# EAGLE design Weihnachtsstern (EAGLE 9.5.1)
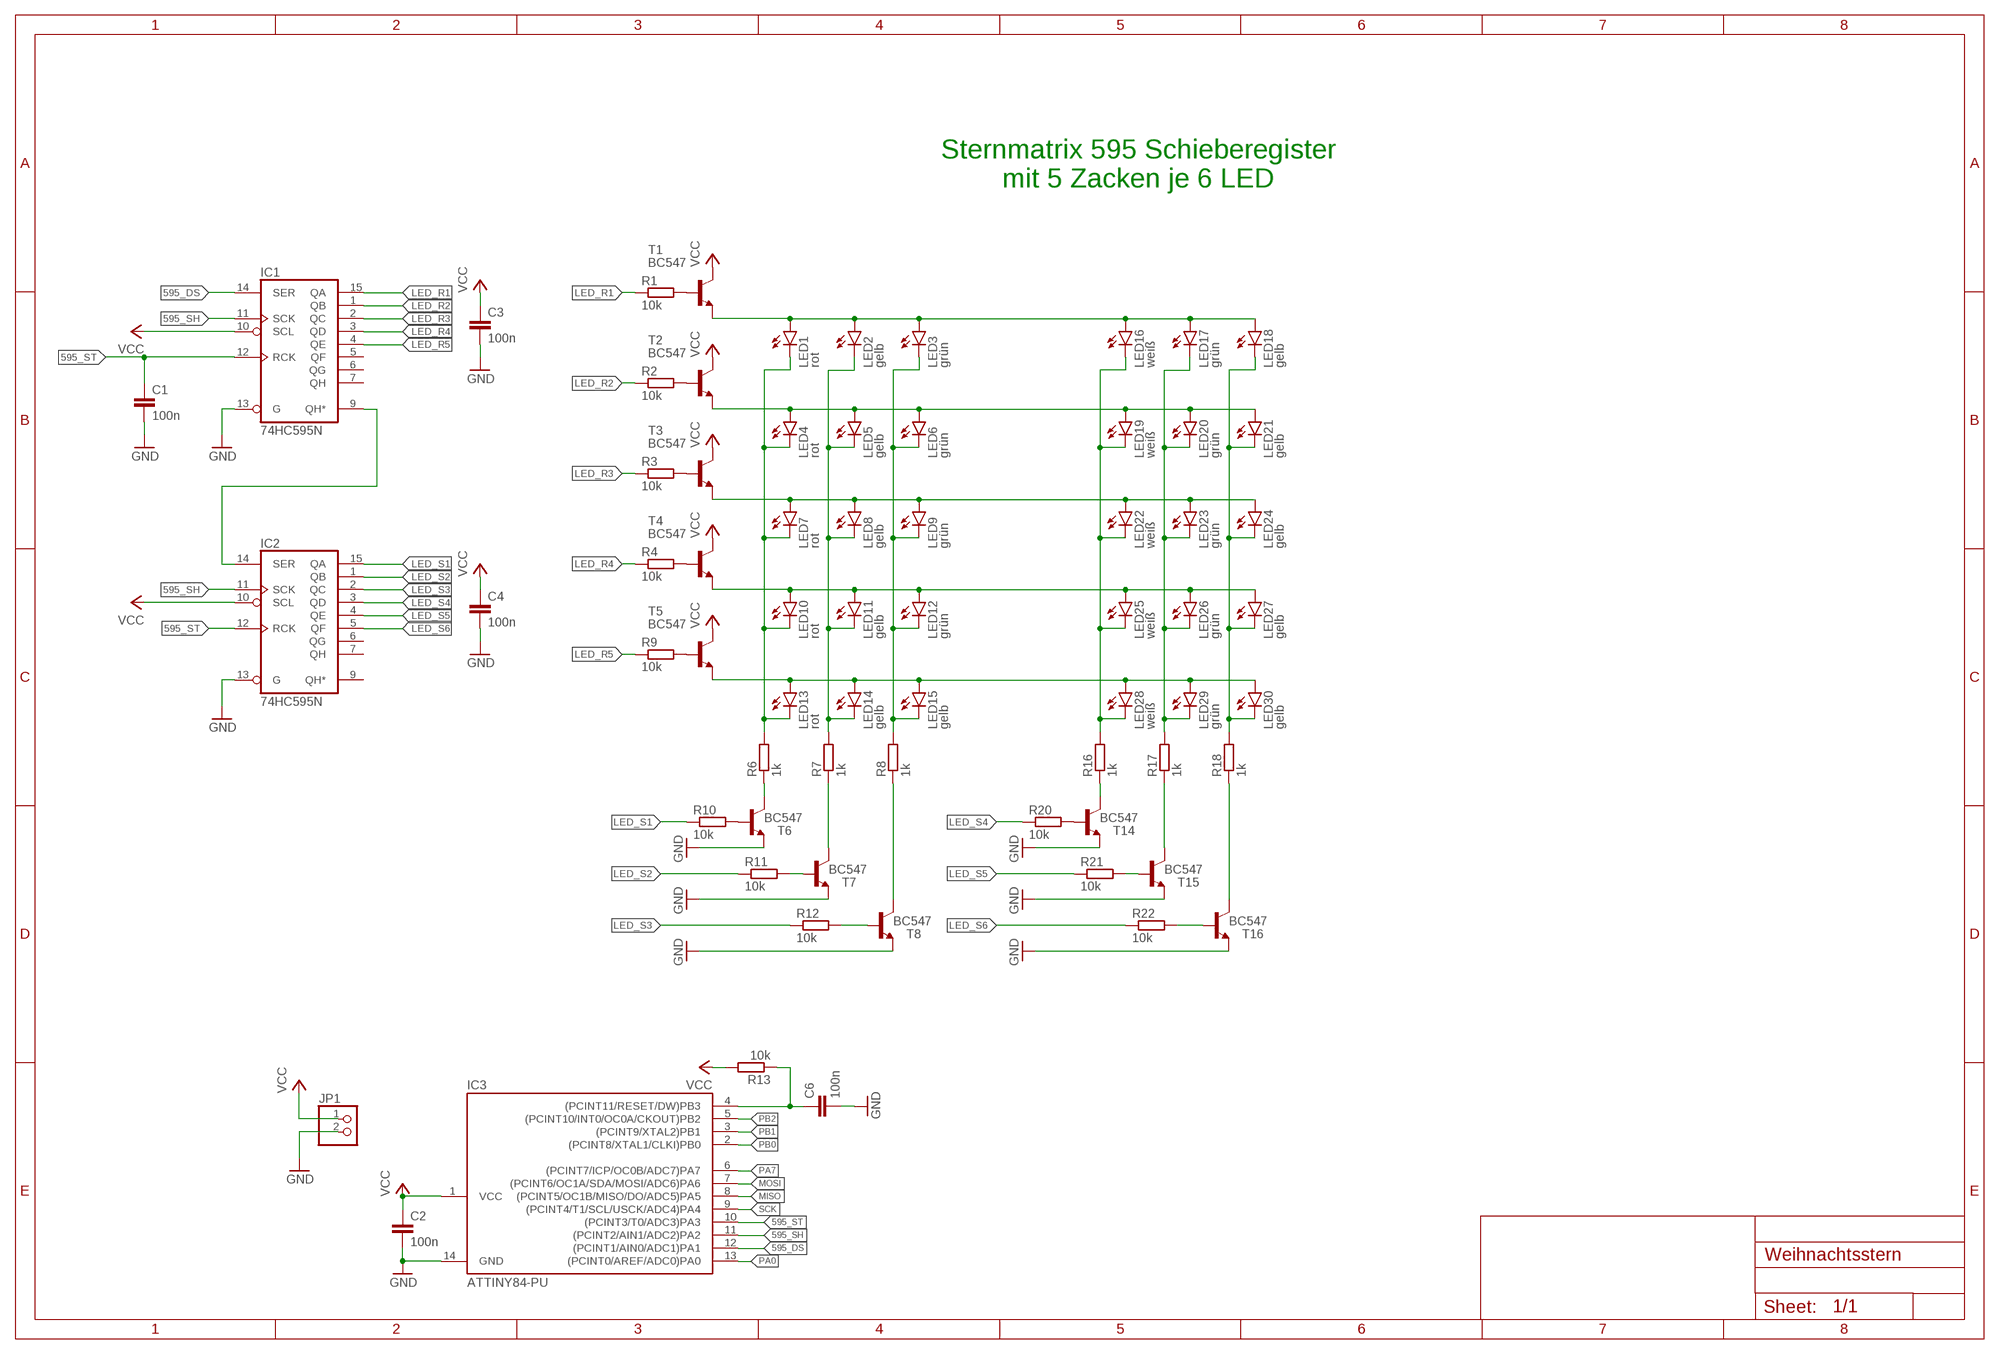
[diagram p0: schematic, sheet 1]

## Parts
C1  100n  C-EU025-024X044  [C025-024X044]
C2  100n  C-EU025-024X044  [C025-024X044]
C3  100n  C-EU025-024X044  [C025-024X044]
C4  100n  C-EU025-024X044  [C025-024X044]
C6  100n  C-EU025-024X044  [C025-024X044]
IC1  74HC595N  [DIL16]
IC2  74HC595N  [DIL16]
IC3  ATTINY84-PU  ATTINY24/44/84-PU  [DIL14]
JP1  PINHD-1X2  [1X02]
LED1  rot  LED3MM  [LED3MM]
LED2  gelb  LED3MM  [LED3MM]
LED3  grün  LED3MM  [LED3MM]
LED4  rot  LED3MM  [LED3MM]
LED5  gelb  LED3MM  [LED3MM]
LED6  grün  LED3MM  [LED3MM]
LED7  rot  LED3MM  [LED3MM]
LED8  gelb  LED3MM  [LED3MM]
LED9  grün  LED3MM  [LED3MM]
LED10  rot  LED3MM  [LED3MM]
LED11  gelb  LED3MM  [LED3MM]
LED12  grün  LED3MM  [LED3MM]
LED13  rot  LED3MM  [LED3MM]
LED14  gelb  LED3MM  [LED3MM]
LED15  gelb  LED3MM  [LED3MM]
LED16  weiß  LED3MM  [LED3MM]
LED17  grün  LED3MM  [LED3MM]
LED18  gelb  LED3MM  [LED3MM]
LED19  weiß  LED3MM  [LED3MM]
LED20  grün  LED3MM  [LED3MM]
LED21  gelb  LED3MM  [LED3MM]
LED22  weiß  LED3MM  [LED3MM]
LED23  grün  LED3MM  [LED3MM]
LED24  gelb  LED3MM  [LED3MM]
LED25  weiß  LED3MM  [LED3MM]
LED26  grün  LED3MM  [LED3MM]
LED27  gelb  LED3MM  [LED3MM]
LED28  weiß  LED3MM  [LED3MM]
LED29  grün  LED3MM  [LED3MM]
LED30  gelb  LED3MM  [LED3MM]
R1  10k  R-EU_0204/5  [0204/5]
R2  10k  R-EU_0204/5  [0204/5]
R3  10k  R-EU_0204/5  [0204/5]
R4  10k  R-EU_0204/5  [0204/5]
R6  1k  R-EU_0204/5  [0204/5]
R7  1k  R-EU_0204/5  [0204/5]
R8  1k  R-EU_0204/5  [0204/5]
R9  10k  R-EU_0204/5  [0204/5]
R10  10k  R-EU_0204/5  [0204/5]
R11  10k  R-EU_0204/5  [0204/5]
R12  10k  R-EU_0204/5  [0204/5]
R13  10k  R-EU_0204/5  [0204/5]
R16  1k  R-EU_0204/5  [0204/5]
R17  1k  R-EU_0204/5  [0204/5]
R18  1k  R-EU_0204/5  [0204/5]
R20  10k  R-EU_0204/5  [0204/5]
R21  10k  R-EU_0204/5  [0204/5]
R22  10k  R-EU_0204/5  [0204/5]
T1  BC547  [TO92]
T2  BC547  [TO92]
T3  BC547  [TO92]
T4  BC547  [TO92]
T5  BC547  -NPN-TO92  [TO92]
T6  BC547  [TO92]
T7  BC547  [TO92]
T8  BC547  [TO92]
T14  BC547  [TO92]
T15  BC547  [TO92]
T16  BC547  [TO92]

## Nets
595_DS: IC1.14(SER) IC3.12((PCINT1/AIN0/ADC1)PA1)
595_SH: IC1.11(SCK) IC2.11(SCK) IC3.11((PCINT2/AIN1/ADC2)PA2)
595_ST: C1.1 IC1.12(RCK) IC2.12(RCK) IC3.10((PCINT3/T0/ADC3)PA3)
GND: C1.2 C2.2 C3.2 C4.2 C6.2 IC1.13(G) IC2.13(G) IC3.14(GND) JP1.2 T6.1(E) T7.1(E) T8.1(E) T14.1(E) T15.1(E) T16.1(E)
LED_R1: IC1.15(QA) R1.1
LED_R2: IC1.1(QB) R2.1
LED_R3: IC1.2(QC) R3.1
LED_R4: IC1.3(QD) R4.1
LED_R5: IC1.4(QE) R9.1
LED_S1: IC2.15(QA) R10.1
LED_S2: IC2.1(QB) R11.1
LED_S3: IC2.2(QC) R12.1
LED_S4: IC2.3(QD) R20.1
LED_S5: IC2.4(QE) R21.1
LED_S6: IC2.5(QF) R22.1
MISO: IC3.8((PCINT5/OC1B/MISO/DO/ADC5)PA5)
MOSI: IC3.7((PCINT6/OC1A/SDA/MOSI/ADC6)PA6)
N$7: R7.1 T7.3(C)
N$9: R1.2 T1.2(B)
N$10: R2.2 T2.2(B)
N$11: R3.2 T3.2(B)
N$12: R4.2 T4.2(B)
N$14: R6.1 T6.3(C)
N$16: R8.1 T8.3(C)
N$17: R9.2 T5.2(B)
N$18: R10.2 T6.2(B)
N$19: R11.2 T7.2(B)
N$20: R12.2 T8.2(B)
N$24: R16.1 T14.3(C)
N$25: R18.1 T16.3(C)
N$27: R20.2 T14.2(B)
N$28: R21.2 T15.2(B)
N$29: R22.2 T16.2(B)
N$36: R17.1 T15.3(C)
PA0: IC3.13((PCINT0/AREF/ADC0)PA0)
PA7: IC3.6((PCINT7/ICP/OC0B/ADC7)PA7)
PB0: IC3.2((PCINT8/XTAL1/CLKI)PB0)
PB1: IC3.3((PCINT9/XTAL2)PB1)
PB2: IC3.5((PCINT10/INT0/OC0A/CKOUT)PB2)
R1: LED1.A LED2.A LED3.A LED16.A LED17.A LED18.A T1.1(E)
R2: LED4.A LED5.A LED6.A LED19.A LED20.A LED21.A T2.1(E)
R3: LED7.A LED8.A LED9.A LED22.A LED23.A LED24.A T3.1(E)
R4: LED10.A LED11.A LED12.A LED25.A LED26.A LED27.A T4.1(E)
R5: LED13.A LED14.A LED15.A LED28.A LED29.A LED30.A T5.1(E)
RESET: C6.1 IC3.4((PCINT11/RESET/DW)PB3) R13.1
S1: LED1.K(C) LED4.K(C) LED7.K(C) LED10.K(C) LED13.K(C) R6.2
S2: LED2.K(C) LED5.K(C) LED8.K(C) LED11.K(C) LED14.K(C) R7.2
S3: LED3.K(C) LED6.K(C) LED9.K(C) LED12.K(C) LED15.K(C) R8.2
S4: LED16.K(C) LED19.K(C) LED22.K(C) LED25.K(C) LED28.K(C) R16.2
S5: LED17.K(C) LED20.K(C) LED23.K(C) LED26.K(C) LED29.K(C) R17.2
S6: LED18.K(C) LED21.K(C) LED24.K(C) LED27.K(C) LED30.K(C) R18.2
SCK: IC3.9((PCINT4/T1/SCL/USCK/ADC4)PA4)
UELAUF: IC1.9(QH*) IC2.14(SER)
VCC: C2.1 C3.1 C4.1 IC1.10(SCL) IC2.10(SCL) IC3.1(VCC) JP1.1 R13.2 T1.3(C) T2.3(C) T3.3(C) T4.3(C) T5.3(C)
Unconnected: IC1.5(QF) IC1.6(QG) IC1.7(QH) IC2.6(QG) IC2.7(QH) IC2.9(QH*)

## Notes on the sheet
- Sternmatrix 595 Schieberegister
  mit 5 Zacken je 6 LED

## Power pins joined to a net without a drawn wire
GND: IC1.8(GND) IC2.8(GND)
VCC: IC1.16(VCC) IC2.16(VCC)

## Library data of the parts
C1-C4 C6 = rcl:C-EU: CAPACITOR, European symbol
IC1 IC2 = 74xx-eu:74*595: 8-bit SHIFT REGISTER, output latch
IC3 = attiny24_44_84:ATTINY24/44/84
JP1 = pinhead:PINHD-1X2: PIN HEADER
LED1-LED30 = MeineBibliothek:LED3MM: Kleine LED
R1-R4 R6-R13 R16-R18 R20-R22 = rcl:R-EU_: RESISTOR, European symbol
T1-T4 T6-T8 T14-T16 = transistor-neu-to92:BC547: NPN TRANSISTOR
T5 = transistor-neu-to92:*-NPN-: NPN Transistror

## Net classes
0 default: width 0.152 mm, drill 0.305 mm, clearance 0.254 mm

## Board
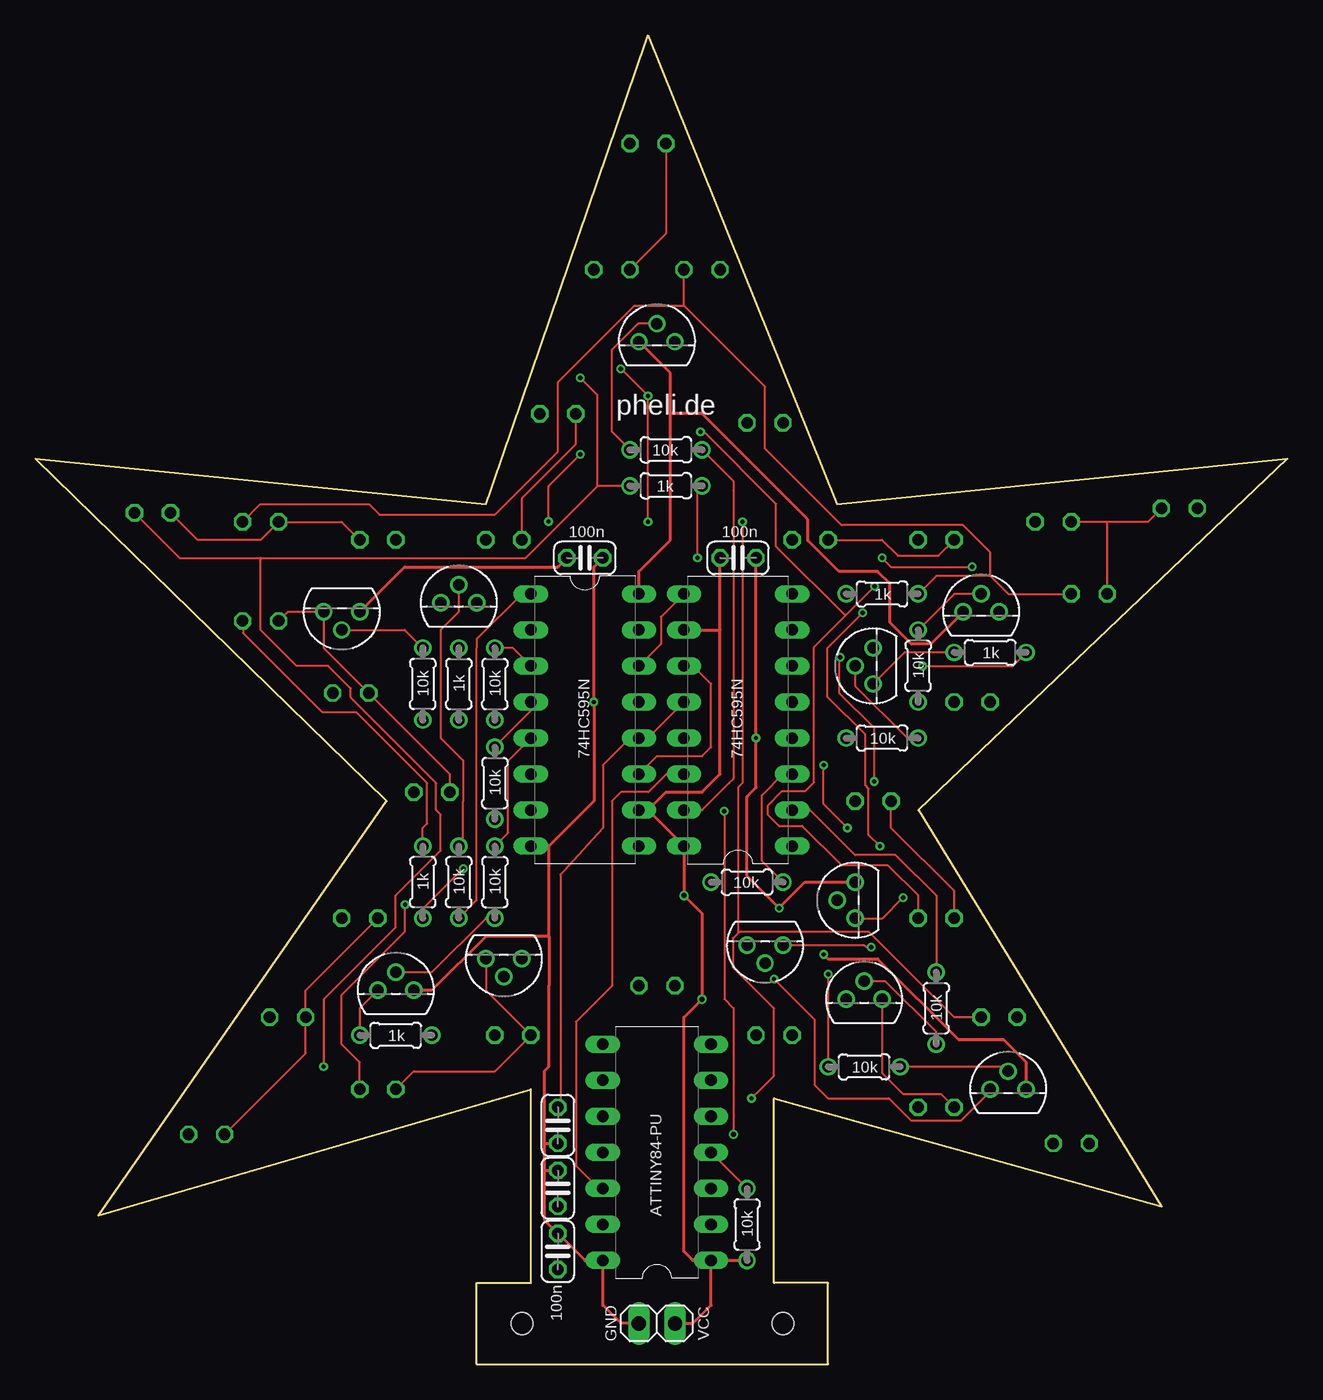
[diagram p1: board, top side]
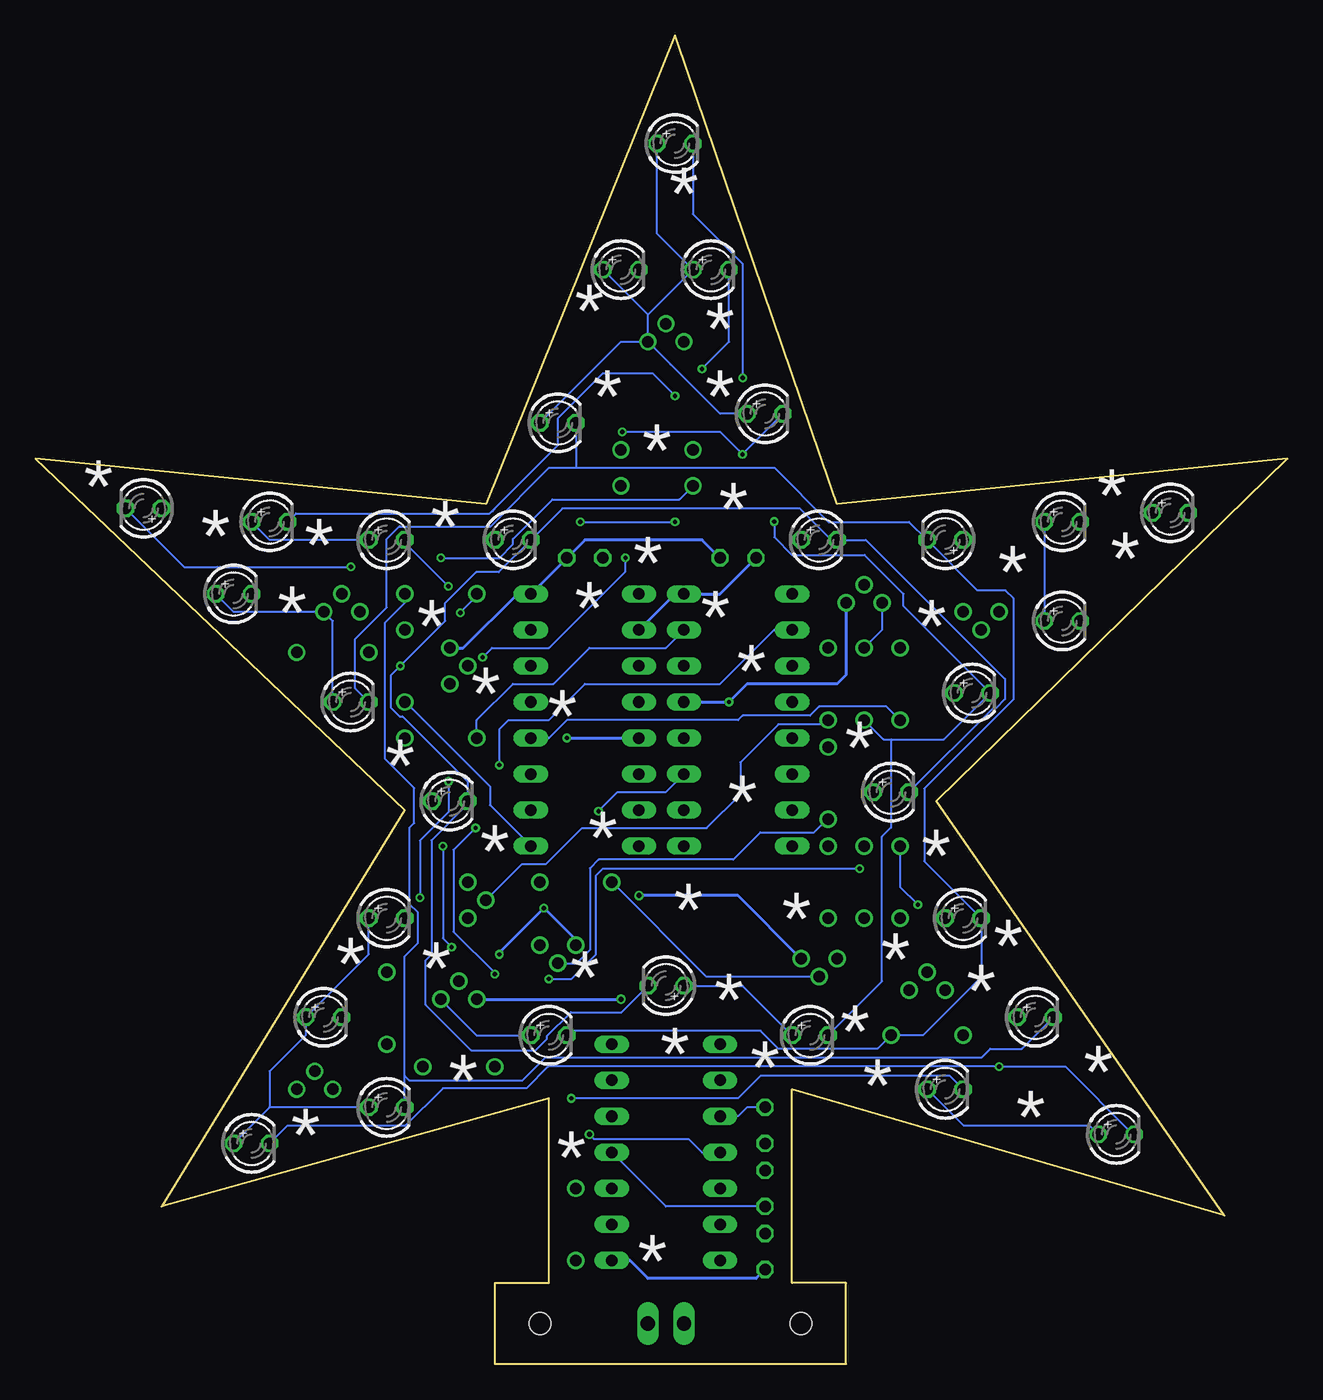
[diagram p2: board, bottom side, seen from below]

Size 88.27 x 93.66 mm. Coordinates in mm from the lower left corner, seen from the top.
Outline: 0,63.82 31.75,60.64 43.18,93.66 56.52,60.64 88.27,63.82 62.23,39.05 79.38,11.11 52.07,18.73 52.07,5.72 55.88,5.72 55.88,0 31.12,0 31.12,5.72 34.93,5.72 34.93,19.37 4.45,10.48 24.77,39.69 0,63.82
Copper layers (1*16): Top 0.035mm / dielectric 1.6mm / Bottom 0.035mm
Design rules "Elecrow_2-layer_PCB_eagle_rule": minimum track width 6mil, minimum drill 12mil, track to track 6mil, track to pad 6mil, pad to pad 6mil, via to via 8mil, smd to smd 0mil, copper to edge 20mil, drill to drill 10mil, minimum pad ring 6mil, minimum via ring 6mil, stop-mask expansion 0mil, vias tented up to drill 100mil, thermal gap 10mil
Holes 1.52 mm at 34.29,2.86 52.7,2.86

### Footprints (pad centres in the part's own frame; a part is rotated, then mirrored left to right if it is on the bottom)
C025-024X044 = drill 0.813 octagon: 1 -1.27,0; 2 1.27,0
DIL16 = drill 0.813 long: 1 -8.89,-3.81; 2 -6.35,-3.81; 3 -3.81,-3.81; 4 -1.27,-3.81; 5 1.27,-3.81; 6 3.81,-3.81; 7 6.35,-3.81; 8 8.89,-3.81; 9 8.89,3.81; 10 6.35,3.81; 11 3.81,3.81; 12 1.27,3.81; 13 -1.27,3.81; 14 -3.81,3.81; 15 -6.35,3.81; 16 -8.89,3.81
DIL14 = drill 0.813 long: 1 -7.62,-3.81; 2 -5.08,-3.81; 3 -2.54,-3.81; 4 0,-3.81; 5 2.54,-3.81; 6 5.08,-3.81; 7 7.62,-3.81; 8 7.62,3.81; 9 5.08,3.81; 10 2.54,3.81; 11 0,3.81; 12 -2.54,3.81; 13 -5.08,3.81; 14 -7.62,3.81
1X02 = drill 1.016 long: 1 -1.27,0; 2 1.27,0
LED3MM = drill 0.813 octagon: A -1.27,0; K 1.27,0
0204/5 = drill 0.813: 1 -2.54,0; 2 2.54,0
TO92 = drill 0.813: 1 1.27,0; 2 0,1.27; 3 -1.27,0

### Placement (x,y rotation side)
C1  36.83,16.83 270 top
C2  49.53,56.83 0 top
C3  38.73,56.83 0 top
C4  36.83,7.94 90 top
C6  36.83,12.38 90 top
IC1  49.53,45.4 90 top
IC2  38.73,45.4 270 top
IC3  43.82,14.92 90 top
JP1  43.82,2.86 180 top
LED1  33.02,58.1 0 bottom
LED2  36.83,66.99 0 bottom
LED3  40.64,77.15 0 bottom
LED4  54.61,58.1 0 bottom
LED5  63.5,58.1 0 bottom
LED6  71.75,59.37 0 bottom
LED7  59.06,39.69 0 bottom
LED8  63.5,31.43 0 bottom
LED9  67.95,24.45 0 bottom
LED10  43.82,26.67 180 bottom
LED11  33.66,23.18 0 bottom
LED12  24.13,19.37 0 bottom
LED13  27.94,40.32 0 bottom
LED14  22.23,47.31 0 bottom
LED15  15.87,52.39 0 bottom
LED16  43.18,86.04 0 bottom
LED17  46.99,77.15 0 bottom
LED18  51.44,66.36 0 bottom
LED19  80.64,60.33 180 bottom
LED20  74.3,54.29 0 bottom
LED21  66.04,46.67 0 bottom
LED22  73.03,15.56 0 bottom
LED23  63.5,18.1 0 bottom
LED24  52.07,23.18 0 bottom
LED25  12.06,16.19 0 bottom
LED26  17.78,24.45 0 bottom
LED27  22.86,31.43 0 bottom
LED28  8.26,60.01 0 bottom
LED29  15.87,59.37 0 bottom
LED30  24.13,58.1 180 bottom
R1  44.45,64.45 180 top
R2  62.23,49.21 90 top
R3  63.5,25.08 270 top
R4  50.16,33.97 180 top
R6  67.31,50.16 0 top
R7  29.84,47.94 270 top
R8  27.3,33.97 90 top
R9  27.3,47.94 90 top
R10  59.69,44.13 0 top
R11  29.84,33.97 90 top
R12  58.42,20.96 0 top
R13  50.16,9.84 270 top
R16  44.45,61.91 180 top
R17  59.69,54.29 0 top
R18  25.4,23.18 0 top
R20  32.39,47.94 270 top
R21  32.39,40.96 270 top
R22  32.39,33.97 270 top
T1  43.82,72.07 0 top
T2  66.67,53.02 0 top
T3  58.42,25.72 0 top
T4  33.02,28.57 180 top
T5  21.59,53.02 180 top
T6  59.06,49.21 90 top
T7  29.84,53.66 0 top
T8  68.58,19.37 0 top
T14  57.79,32.7 90 top
T15  51.44,29.53 180 top
T16  25.4,26.35 0 top

### Tracks (layer width: path | path; a pad name or v marks a point on that pad's centre or on a via)
595_DS
  Top 0.152: IC1.14 44.48,41.59 43.21,40.32 41.27,40.32 40.64,39.69 40.64,26.67 38.1,24.13 38.1,13.97 39.69,12.38 IC3.12
595_SH  (via drill 0.3, 0.35)
  Top 0.152: IC2.11 43.82,42.86 46.99,42.86 47.62,43.5 47.62,47.94 46.36,49.21 IC1.11 | v49.21,16.19 49.21,25.08 48.57,25.73 v48.57,38.98
  Bottom 0.152: IC2.11 43.82,40.32 47.22,40.32 v48.57,38.98 | v49.21,16.19 48.9,15.87 42.23,15.87 41.27,14.92 IC3.11
595_ST
  Top 0.152: IC1.12 43.18,44.13 IC2.12 41.91,44.13 40.01,42.23 40.01,37.78 37.59,35.12 37.29,34.79 37.01,34.51 37.01,18.28 C1.1
  Bottom 0.152: IC3.10 38.73,17.46 38.1,18.1 C1.1
GND  (via drill 0.3)
  Top 0.203: 35.87,15.56 35.87,20.64 36.19,20.96 36.19,26.67 36.2,26.68 36.2,30.16 | 36.2,36.51 IC2.8 | C3.2 39.37,56.2 v39.37,46.67 39.37,39.69 36.2,36.51 | 35.87,15.56 35.87,13.65 | 35.87,13.65 35.87,10.17 C4.2 38.73,7.3 IC3.14 40.01,4.13 41.27,2.86 JP1.2 | 35.87,13.65 C6.2 | 35.87,15.56 C1.2 | C2.2 v50.8,44.13 50.8,40.64 50.16,40.01 50.16,34.41 v52.43,32.15 54.25,33.97 T14.1 | T8.1 69.85,21.27 68.26,22.86 65.09,22.86 59.37,28.57 55.87,28.57 v55.56,28.88 | T16.1 27.94,26.35 31.75,30.16 36.2,30.16 | 36.2,30.16 36.2,36.51
  Bottom 0.203: T7.1 31.12,48.58 31.75,47.94 38.1,47.94 v39.37,46.67 IC2.13 | C3.2 41.27,58.1 49.53,58.1 C2.2 IC1.8 54.29,54.29 58.1,50.48 T6.1 | v50.8,44.13 IC1.13 | T15.1 50.16,29.89 v52.43,32.15 55.56,29.01 v55.56,28.88
LED_R1
  Top 0.152: IC1.15 46.99,39.05 48.9,40.96 49.2,41.26 49.2,61.59 49.2,62.24 R1.1
LED_R2
  Bottom 0.152: R2.1 62.18,46.67 56.23,40.72 56.23,39.4 IC1.1
LED_R3
  Top 0.152: IC1.2 54.61,39.05 57.79,35.88 60.64,35.88 63.5,33.02 R3.1
LED_R4
  Top 0.152: IC1.3 52.7,41.59 51.21,40.09 51.21,35.47 R4.1
LED_R5
  Bottom 0.152: R9.1 28.26,46.36 33.02,46.36 33.66,45.72 38.42,45.72 38.73,45.4 50.8,45.4 52.07,44.13 IC1.4
LED_S1
  Bottom 0.152: R10.1 57.15,45.4 54.61,47.94 51.75,47.94 49.21,50.48 43.82,50.48 IC2.15
LED_S2
  Top 0.152: IC2.1 34.29,54.29 31.12,51.12 31.12,50.48 31.12,32.7 R11.1
LED_S3  (via drill 0.3)
  Top 0.152: v55.88,27.48 R12.1 | v57.24,37.8 55.56,39.47 v55.56,42.23
  Bottom 0.152: v55.88,27.48 55.88,27.57 58.79,30.48 58.79,36.25 v57.24,37.8 | IC2.2 36.2,51.75 40.01,47.94 49.53,47.94 52.07,45.4 54.93,45.4 55.56,44.77 v55.56,42.23
LED_S4
  Top 0.152: IC2.3 33.66,50.48 R20.1
LED_S5
  Top 0.152: IC2.4 34.93,46.07 32.39,43.53 R21.1
LED_S6
  Top 0.152: IC2.5 33.33,42.53 33.33,37.45 R22.1
N$7
  Bottom 0.152: T7.3 28.58,51.75 R7.1
N$9
  Top 0.152: R1.2 40.64,65.72 40.64,69.51 40.62,69.53 40.62,71.47 42.49,73.34 T1.2
N$10
  Top 0.152: T2.2 64.77,54.29 R2.2
N$11
  Top 0.152: T3.2 59.92,26.99 63.5,23.41 R3.2
N$12
  Bottom 0.152: T4.2 40.96,27.3 R4.2
N$14
  Top 0.152: R6.1 61.28,50.16 60.33,49.21 T6.3
N$16  (via drill 0.3)
  Top 0.152: v52.07,27.15 54.93,24.29 54.93,19.69 55.88,18.73 60.17,18.73 61.75,17.14 65.25,17.14 67.31,19.21 T8.3 | v30.16,34.92 27.3,32.07 R8.1
  Bottom 0.152: v52.07,27.15 50.48,27.15 48.78,28.85 48.78,34.41 48.26,34.92 v30.16,34.92
N$17
  Top 0.152: R9.2 26.03,51.75 T5.2
N$18
  Top 0.152: R10.2 61.47,44.13 57.79,47.82 T6.2
N$19
  Top 0.152: T7.2 29.84,53.02 28.58,51.75 28.58,44.13 30.15,42.56 30.15,39.69 30.15,36.82 R11.2
N$20
  Top 0.152: T8.2 68.26,20.96 R12.2
N$24  (via drill 0.3)
  Top 0.152: T14.3 59.72,31.43 v61.16,32.88 | v59.14,41.07 59.14,44.84 56.69,47.28 56.69,49.77 v56.74,49.82 | v46.67,56.83 46.67,61.59 R16.1
  Bottom 0.152: v56.74,49.82 56.09,50.48 52.07,50.48 46.67,55.88 v46.67,56.83 | v61.16,32.88 61.16,36.91 59.14,38.93 v59.14,41.07
N$25
  Top 0.152: T16.3 22.86,25.08 R18.1
N$27
  Bottom 0.152: T14.2 53.98,35.24 52.27,35.24 49.73,37.78 40.96,37.78 38.58,40.16 38.58,42.42 35.89,45.1 32.69,45.1 R20.2
N$28
  Bottom 0.152: R21.2 32.51,38.34 33.38,37.48 37.16,37.48 39.07,35.57 48.57,35.57 49.18,34.95 49.18,29.18 50.11,28.26 T15.2
N$29
  Top 0.152: R22.2 31.75,31.43 27.94,27.62 T16.2
N$36  (via drill 0.3)
  Top 0.152: T15.3 58.42,29.53 58.55,29.4 v58.92,29.4 | v58.32,52.97 55.84,50.49 55.84,47.03 58.5,44.37 58.5,40.81 58.74,40.57 58.74,37.31 v59.54,36.51
  Bottom 0.152: v58.32,52.97 57.15,54.14 R17.1 | v59.54,36.51 59.54,30.01 v58.92,29.4
R1
  Top 0.152: LED16.A 44.45,79.69 LED3.A | LED2.A 38.1,64.86 34.29,61.05 LED1.A
  Bottom 0.152: T1.1 45.11,72.07 46.99,72.07 LED18.A | T1.1 45.09,73.98 | 45.09,73.98 LED17.A | 45.09,73.98 LED3.A 44.45,79.69 LED16.A | T1.1 43.5,70.48 40.01,66.99 LED2.A
R2
  Top 0.152: 75.56,59.37 LED6.A | LED20.A 75.56,59.37 | LED5.A 63.66,56.99 60.8,56.99 59.69,58.1 LED4.A | LED19.A 78.42,59.37 75.56,59.37
  Bottom 0.152: LED20.A 74.3,53.02 T2.1 67.31,52.39 LED21.A | LED6.A 71.75,58.1 LED5.A
R3
  Top 0.152: LED7.A 60.33,37.78 64.77,33.34 LED8.A | LED23.A 63.83,19.04 61.16,19.04 59.69,20.51 T3.1
  Bottom 0.152: LED24.A 57.18,23.18 59.69,25.69 T3.1 | LED23.A 71.75,18.1 | 71.75,18.1 LED22.A | LED8.A 64.77,28.89 LED9.A 69.22,23.18 71.75,20.64 71.75,18.1
R4
  Top 0.152: LED27.A 19.05,26.35 LED26.A 19.05,21.91 LED25.A | T4.1 31.75,26.35 LED11.A 32.39,20.64 26.67,20.64 LED12.A
  Bottom 0.152: LED12.A 22.86,16.83 13.97,16.83 LED25.A | LED10.A 38.42,26.67 LED11.A
R5
  Top 0.152: LED28.A 11.43,58.1 15.87,58.1 LED29.A 21.59,59.37 LED30.A | LED13.A 29.21,41.59 LED14.A 20.32,50.48 T5.1 17.78,53.02 LED15.A
  Bottom 0.152: LED29.A LED15.A
RESET
  Top 0.152: R13.1 IC3.4
  Bottom 0.152: C6.1 43.82,11.11 IC3.4
S1  (via drill 0.3)
  Top 0.152: R6.2 68.9,49.21 v62.55,49.21
  Bottom 0.152: LED13.K 20.73,46.27 20.52,46.27 19.91,46.88 19.91,48.3 29.72,58.1 LED1.K 32.16,58.1 34.38,60.33 51.12,60.33 LED4.K 55.61,55.83 57.2,55.83 59.37,53.66 59.37,52.39 v62.55,49.21 63.2,48.56 63.2,46.27 62.59,45.66 62.38,45.66 57.79,41.06 LED7.K 57.79,39.48 60.35,36.92 60.35,28.87 60.76,28.46 60.76,25.34 57.51,22.09 53.04,22.09 52.22,22.9 52.22,23.1 50.52,24.8 46.95,24.8 LED10.K
S2  (via drill 0.3)
  Top 0.152: v59.16,54.83 57.1,52.77 | 57.1,52.77 52.22,57.65 52.22,60.64 47.14,65.72 v46.89,65.72 | 57.1,52.77 54.89,50.56 54.89,41.01 54.27,40.39 52.64,40.39 51.61,39.36 51.61,38.75 52.43,37.93 54.05,37.93 56.84,35.14 60.11,35.14 62.23,33.02 LED8.K | v36.18,59.39 36.18,61.89 v38.42,64.13
  Bottom 0.152: 27.94,44.03 28.47,44.03 R7.2 | 27.94,44.03 24.23,44.03 LED14.K 27.07,53.42 27.07,54.29 29.81,57.04 34.93,57.04 36.18,58.29 v36.18,59.39 | LED5.K 62.23,57.9 v59.16,54.83 | v46.89,65.72 40.01,65.72 v38.42,64.13 LED2.K | 27.94,44.03 27.94,37.83 28.58,37.19 28.58,26.99 LED11.K
S3  (via drill 0.3)
  Top 0.152: LED15.K 14.63,52.36 14.63,51.55 20.23,45.95 22.63,45.95 27.62,40.96 27.62,38.1 27.3,37.78 R8.2 | 49.53,30.37 49.17,30.01 49.17,27.98 52.07,25.08 52.07,20.32 v50.48,18.73 | LED9.K 64.77,24.45 58.75,30.47 49.63,30.47 49.53,30.37 | v43.18,59.37 v43.18,68.26 v41.27,70.17 | 49.53,30.37 49.53,40.64 49.86,40.97 49.86,59.36 v49.85,59.37 | LED12.K 22.86,21.27 21.59,22.54 21.59,26.03 26.06,30.5 v26.06,32.39
  Bottom 0.152: v41.27,70.17 39.37,72.07 LED3.K | v49.85,59.37 v43.18,59.37 | LED12.K 23.81,20.32 37.15,20.32 38.73,18.73 v50.48,18.73 | v26.06,32.39 27.3,33.63 R8.2 | LED6.K 69.89,59.97 56.24,59.97 56.11,60.1 56.01,60.14 55.97,60.24 55.89,60.3 55.88,60.32 51.44,64.77 51.44,66.67 48.26,69.85 44.77,69.85 v43.18,68.26
S4  (via drill 0.3)
  Top 0.152: v66.04,56.2 60.33,56.2 v59.69,56.83 | 15.87,56.83 10.16,56.83 LED28.K | 15.87,56.83 34.54,56.83 39.62,61.91 | 15.87,56.83 15.87,51.75 18.41,49.21 20.64,49.21 22.23,47.62 22.23,46.99 28.26,40.96 28.26,39.05 28.58,38.73 28.58,36.19 25.4,33.02 25.4,30.8 20.32,25.72 v20.32,20.98 | R16.2 39.62,61.91 | 39.62,61.91 39.62,68.31 v38.41,69.53
  Bottom 0.152: v38.41,69.53 38.41,77.56 41.91,81.06 LED16.K | v66.04,56.2 75.25,56.2 75.43,56.2 77.79,56.2 LED19.K | R16.2 42.86,60.96 51.81,60.96 54.6,58.17 54.6,57.8 55.56,56.83 v59.69,56.83 | LED25.K 10.88,16.19 15.67,20.98 v20.32,20.98 52.12,20.98 53.66,19.44 59.54,19.44 62.19,16.79 70.52,16.79 LED22.K
S5
  Top 0.152: R17.2 63.5,55.56 67.31,55.56 | LED29.K 15.85,60.62 23.52,60.62 24.26,59.88 32.39,59.88 36.83,64.33 36.83,69.22 42.23,74.61 45.72,74.61 | 45.72,74.61 LED17.K | 67.31,55.56 68.58,54.29 LED20.K | 67.31,55.56 67.31,57.22 65.4,59.13 56.83,59.13 51.44,64.53 51.44,68.9 45.72,74.61
  Bottom 0.152: LED26.K 18.73,22.23 20.95,22.23 21.59,21.59 52.36,21.59 53.98,19.97 61.88,19.97 62.23,20.32 | LED23.K 62.23,20.32 | 62.23,20.32 62.23,28.74 61.29,29.68 61.29,31.82 61.91,32.44 61.91,37.78 61.56,38.13 61.56,40.61 63.6,42.65 63.6,52.29 62.23,53.66 R17.2
S6
  Bottom 0.152: 50.16,63.18 36.17,63.18 32.36,59.37 26.67,59.37 LED30.K 21.84,54.55 19.88,54.55 19.3,53.98 19.3,46.88 25.6,40.58 25.6,35.45 LED27.K 21.59,27.3 25.72,23.18 R18.2 28.89,22.23 35.88,22.23 37.15,23.5 50.64,23.5 50.64,23.34 LED24.K | LED21.K 65.72,47.62 65.72,51.12 63.5,53.34 63.5,58.16 62.62,59.04 62.56,59.04 62.55,59.05 56.2,59.05 52.07,63.18 50.16,63.18 | LED18.K 50.16,63.18
UELAUF
  Top 0.152: IC2.14 44.09,50.76 44.09,52.67 IC1.9
VCC  (via drill 0.35)
  Top 0.203: T2.3 63.13,50.75 61.76,50.75 60.22,52.29 60.22,55.03 59.37,55.88 56.63,55.88 54.46,58.05 54.46,59.52 46.99,66.99 44.77,66.99 | 43.18,39.05 44.45,40.32 46.99,40.32 48.26,41.59 48.26,51.75 | 48.26,51.75 C2.1 | T1.3 44.77,69.85 44.77,66.99 | IC2.10 43.18,39.05 | 43.18,39.05 IC1.16 v45.72,33.02 46.99,31.75 v46.99,25.72 45.72,24.45 45.72,7.94 46.36,7.3 IC3.1 | IC3.1 R13.2 | IC1.10 48.26,51.75 | JP1.1 46.36,2.86 47.62,4.13 IC3.1 | T5.3 26.03,56.2 36.83,56.2 C3.1 | IC2.16 42.55,55.88 44.77,58.1 44.77,66.99
  Bottom 0.203: C3.1 40.01,54.29 IC2.16 43.18,54.29 IC1.10 | C4.1 37.47,6.03 45.09,6.03 46.36,7.3 IC3.1 | T4.3 38.73,33.02 v45.72,33.02 | T3.3 v46.99,25.72

### Text on the board
tPlace: pheli.de | GND | VCC
bPlace: * | * | * | * | * | * | * | * | * | * | * | * | * | * | * | * | * | * | * | * | * | * | * | * | * | * | * | * | * | * | * | * | * | * | * | * | * | * | * | * | * | * | * | * | * | * | * | *